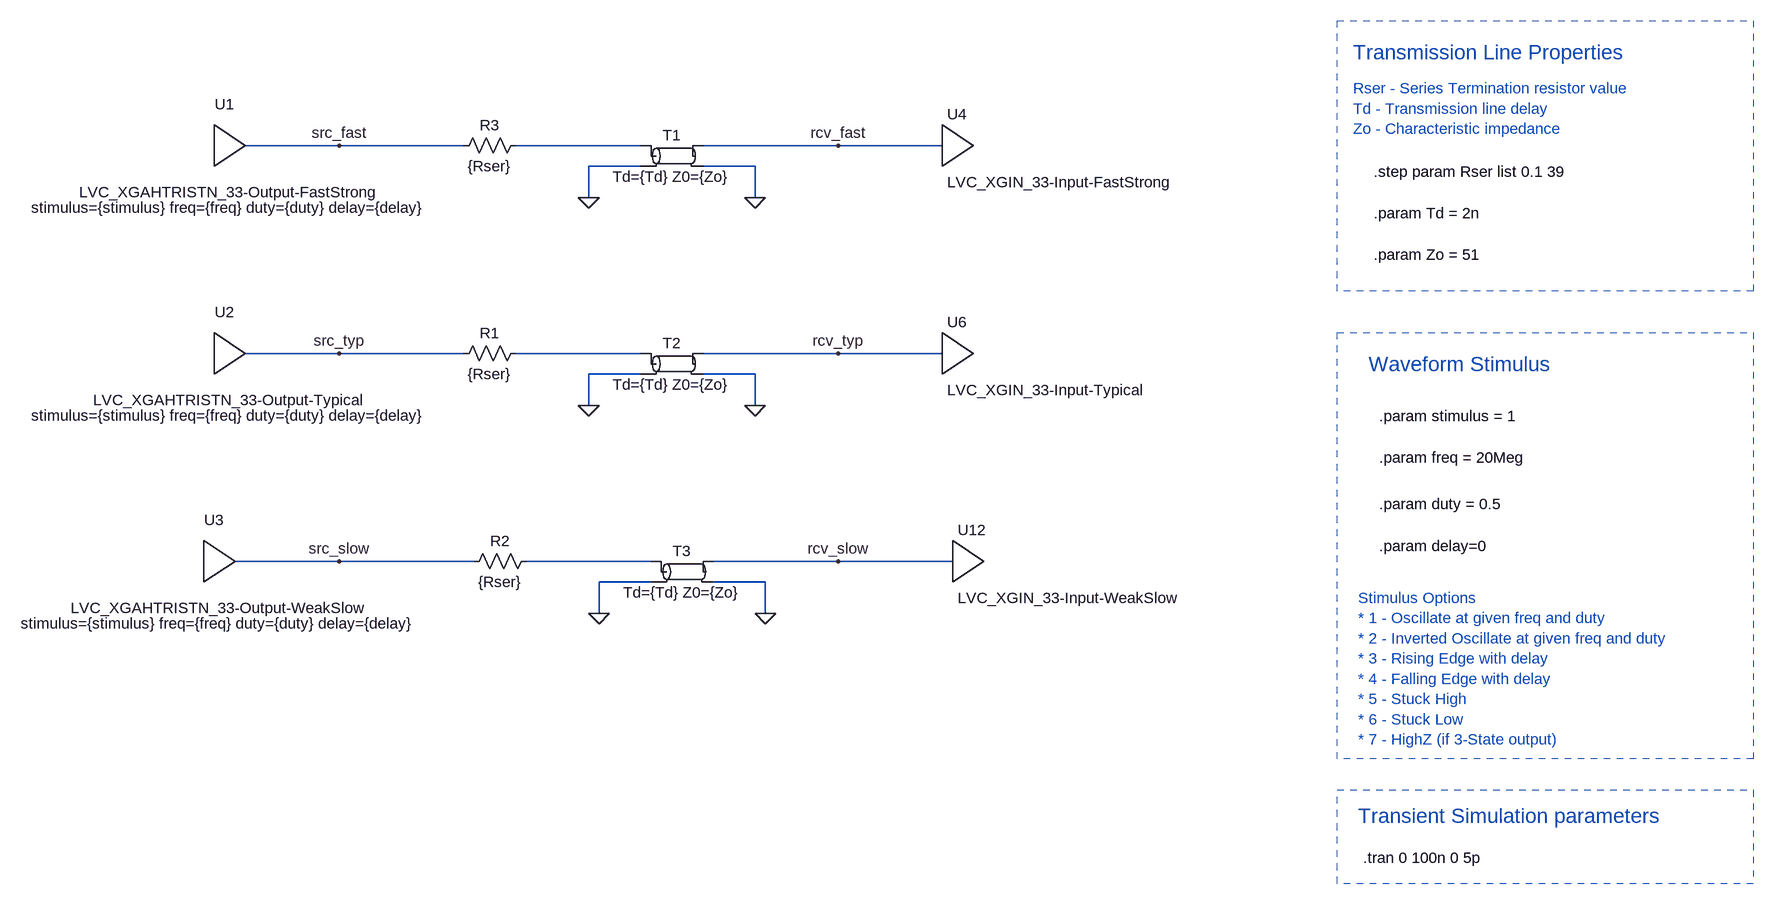
[diagram p0: schematic lvc2g126_33.asc]
lvc2g126_33.asc, the LTspice schematic file:
Version 4
SHEET 1 1856 1444
WIRE -816 288 -960 288
WIRE -624 288 -816 288
WIRE -352 288 -544 288
WIRE -48 288 -256 288
WIRE 112 288 -48 288
WIRE -352 320 -432 320
WIRE -176 320 -256 320
WIRE -432 368 -432 320
WIRE -176 368 -176 320
WIRE -816 608 -960 608
WIRE -624 608 -816 608
WIRE -352 608 -544 608
WIRE -48 608 -256 608
WIRE 112 608 -48 608
WIRE -352 640 -432 640
WIRE -176 640 -256 640
WIRE -432 688 -432 640
WIRE -176 688 -176 640
WIRE -816 928 -976 928
WIRE -608 928 -816 928
WIRE -336 928 -528 928
WIRE -48 928 -240 928
WIRE 128 928 -48 928
WIRE -336 960 -416 960
WIRE -160 960 -240 960
WIRE -416 1008 -416 960
WIRE -160 1008 -160 960
FLAG -432 368 0
FLAG -176 368 0
FLAG -48 288 rcv_fast
FLAG -48 608 rcv_typ
FLAG -48 928 rcv_slow
FLAG -816 288 src_fast
FLAG -816 608 src_typ
FLAG -816 928 src_slow
FLAG -432 688 0
FLAG -176 688 0
FLAG -416 1008 0
FLAG -160 1008 0
SYMBOL tline -304 304 R0
SYMATTR InstName T1
SYMATTR Value Td={Td} Z0={Zo}
SYMBOL res -528 272 R90
WINDOW 0 0 56 VBottom 2
WINDOW 3 32 56 VTop 2
SYMATTR InstName R3
SYMATTR Value {Rser}
SYMBOL res -528 592 R90
WINDOW 0 0 56 VBottom 2
WINDOW 3 32 56 VTop 2
SYMATTR InstName R1
SYMATTR Value {Rser}
SYMBOL res -512 912 R90
WINDOW 0 0 56 VBottom 2
WINDOW 3 32 56 VTop 2
SYMATTR InstName R2
SYMATTR Value {Rser}
SYMBOL tline -304 624 R0
SYMATTR InstName T2
SYMATTR Value Td={Td} Z0={Zo}
SYMBOL tline -288 944 R0
SYMATTR InstName T3
SYMATTR Value Td={Td} Z0={Zo}
SYMBOL LVC_XGAHTRISTN_33-Output-FastStrong -992 320 R0
SYMATTR InstName U1
SYMATTR SpiceLine stimulus={stimulus} freq={freq} duty={duty} delay={delay}
SYMBOL LVC_XGAHTRISTN_33-Output-Typical -992 640 R0
SYMATTR InstName U2
SYMATTR SpiceLine stimulus={stimulus} freq={freq} duty={duty} delay={delay}
SYMBOL LVC_XGAHTRISTN_33-Output-WeakSlow -1008 960 R0
SYMATTR InstName U3
SYMATTR SpiceLine stimulus={stimulus} freq={freq} duty={duty} delay={delay}
SYMBOL LVC_XGIN_33-Input-FastStrong 112 224 R0
SYMATTR InstName U4
SYMBOL LVC_XGIN_33-Input-Typical 112 544 R0
SYMATTR InstName U6
SYMBOL LVC_XGIN_33-Input-WeakSlow 128 864 R0
SYMATTR InstName U12
TEXT 760 1384 Left 2 !.tran 0 100n 0 5p
TEXT 776 328 Left 2 !.step param Rser list 0.1 39
TEXT 776 392 Left 2 !.param Td = 2n
TEXT 776 456 Left 2 !.param Zo = 51
TEXT 784 704 Left 2 !.param stimulus = 1
TEXT 784 768 Left 2 !.param freq = 20Meg
TEXT 784 840 Left 2 !.param duty = 0.5
TEXT 784 904 Left 2 !.param delay=0
TEXT 744 144 Left 3 ;Transmission Line Properties
TEXT 744 200 Left 2 ;Rser - Series Termination resistor value\nTd - Transmission line delay\nZo - Characteristic impedance
TEXT 752 984 Left 2 ;Stimulus Options\n* 1 - Oscillate at given freq and duty\n* 2 - Inverted Oscillate at given freq and duty\n* 3 - Rising Edge with delay\n* 4 - Falling Edge with delay\n* 5 - Stuck High\n* 6 - Stuck Low\n* 7 - HighZ (if 3-State output)
TEXT 752 1320 Left 3 ;Transient Simulation parameters
TEXT 768 624 Left 3 ;Waveform Stimulus
RECTANGLE Normal 1360 1424 720 1280 2
RECTANGLE Normal 1360 1232 720 576 2
RECTANGLE Normal 1360 512 720 96 2

The netlist it stands for:
* lvc2g126_33.asc
T1 N001 0 rcv_fast 0 Td={Td} Z0={Zo}
R3 N001 src_fast {Rser}
R1 N002 src_typ {Rser}
R2 N003 src_slow {Rser}
T2 N002 0 rcv_typ 0 Td={Td} Z0={Zo}
T3 N003 0 rcv_slow 0 Td={Td} Z0={Zo}
XU1 src_fast LVC_XGAHTRISTN_33-Output-FastStrong stimulus={stimulus} freq={freq} duty={duty} delay={delay}  ; pins OUT
XU2 src_typ LVC_XGAHTRISTN_33-Output-Typical stimulus={stimulus} freq={freq} duty={duty} delay={delay}  ; pins OUT
XU3 src_slow LVC_XGAHTRISTN_33-Output-WeakSlow stimulus={stimulus} freq={freq} duty={duty} delay={delay}  ; pins OUT
XU4 rcv_fast LVC_XGIN_33-Input-FastStrong  ; pins IN
XU6 rcv_typ LVC_XGIN_33-Input-Typical  ; pins IN
XU12 rcv_slow LVC_XGIN_33-Input-WeakSlow  ; pins IN
.tran 0 100n 0 5p
.step param Rser list 0.1 39
.param Td = 2n
.param Zo = 51
.param stimulus = 1
.param freq = 20Meg
.param duty = 0.5
.param delay=0
* Transmission Line Properties
* Rser - Series Termination resistor value
* Td - Transmission line delay
* Zo - Characteristic impedance
* Stimulus Options
* * 1 - Oscillate at given freq and duty
* * 2 - Inverted Oscillate at given freq and duty
* * 3 - Rising Edge with delay
* * 4 - Falling Edge with delay
* * 5 - Stuck High
* * 6 - Stuck Low
* * 7 - HighZ (if 3-State output)
* Transient Simulation parameters
* Waveform Stimulus
.lib LVC_XGAHTRISTN_33-Output-FastStrong.sub
.lib LVC_XGAHTRISTN_33-Output-Typical.sub
.lib LVC_XGAHTRISTN_33-Output-WeakSlow.sub
.lib LVC_XGIN_33-Input-FastStrong.sub
.lib LVC_XGIN_33-Input-Typical.sub
.lib LVC_XGIN_33-Input-WeakSlow.sub
.backanno
.end